# Altium project DeepPlankter_main.PrjPcb (part 2 of 2)

## Sheet power_connector.SchDoc
size A4
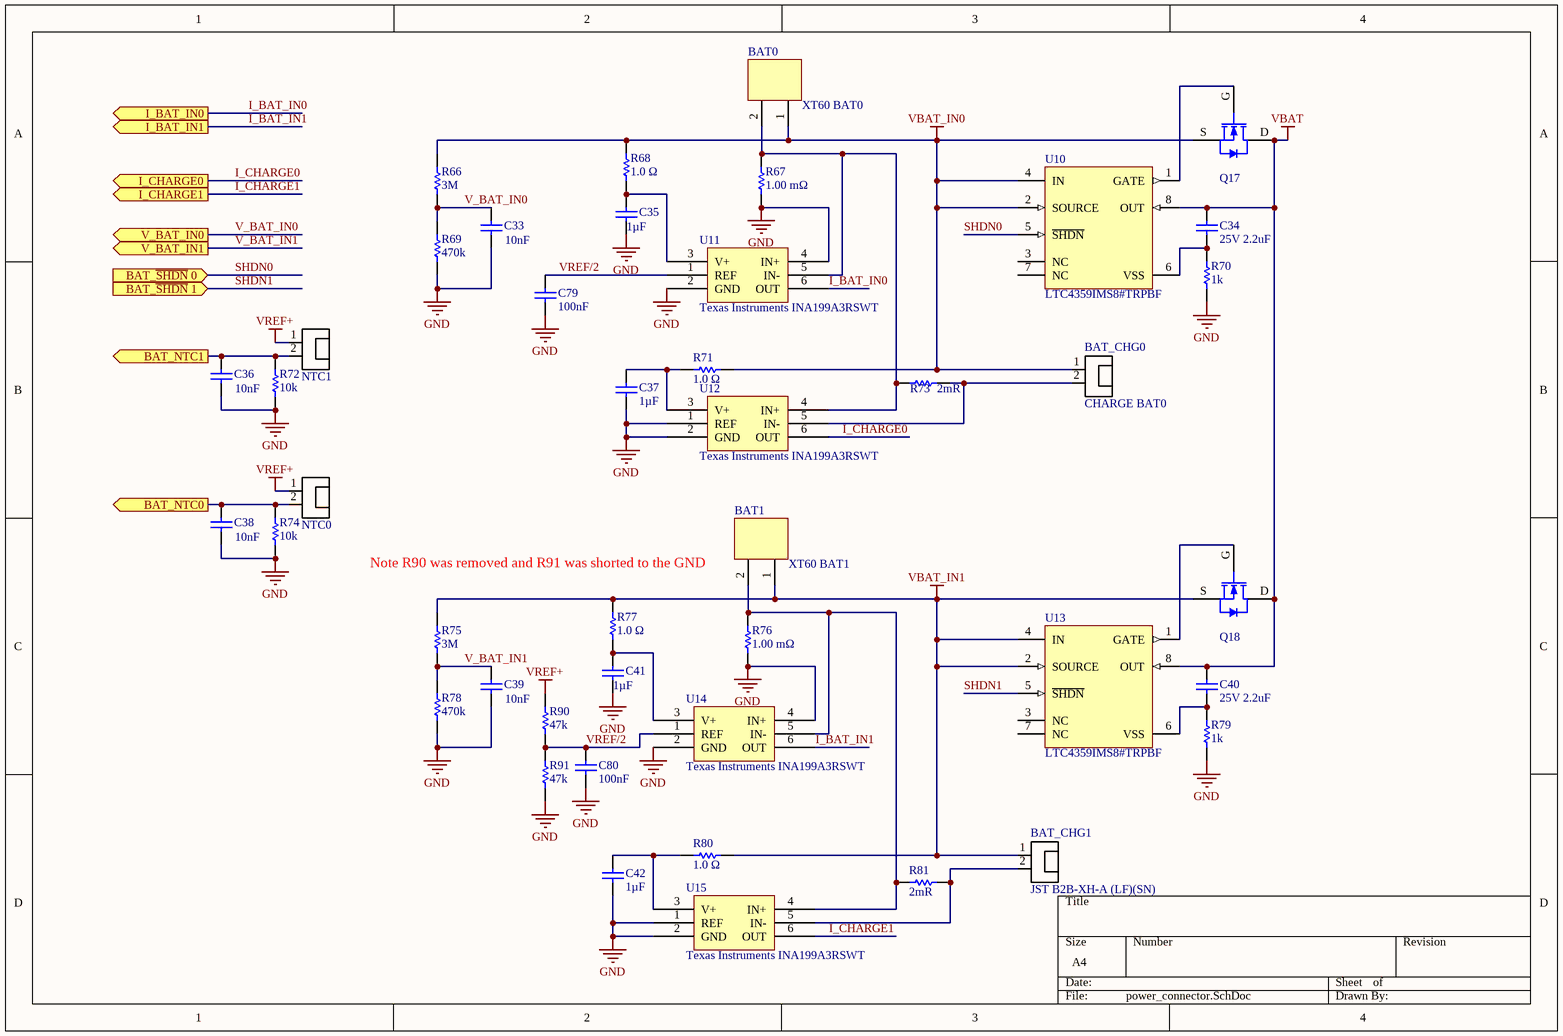
[diagram p5: power_connector.SchDoc]

### Parts
BAT0  XT60 BAT0  [PCB-8tmbcd94dx0l5ponnqur-1]
BAT1  XT60 BAT1  [PCB-8tmbcd94dx0l5ponnqur-1]
BAT_CHG0  CHARGE BAT0  [PCB-s8s8ac3ylnu6waak0fxh-1]
BAT_CHG1  JST B2B-XH-A (LF)(SN)  [PCB-s8s8ac3ylnu6waak0fxh-1]
C33  10nF  [RESC1005X40X25LL05T05]
C34  25V 2.2uF  [C0805]
C35  1µF  [CAPC1608X90X35LL15T15]
C36  10nF  [RESC1005X40X25LL05T05]
C37  1µF  [CAPC1608X90X35LL15T15]
C38  10nF  [RESC1005X40X25LL05T05]
C39  10nF  [RESC1005X40X25LL05T05]
C40  25V 2.2uF  [C0805]
C41  1µF  [CAPC1608X90X35LL15T15]
C42  1µF  [CAPC1608X90X35LL15T15]
C79  100nF  [CAPC1005X56X25NL10T15]
C80  100nF  [CAPC1005X56X25NL10T15]
NTC0  JST B2B-XH-A (LF)(SN)  [PCB-s8s8ac3ylnu6waak0fxh-1]  (value not drawn)
NTC1  JST B2B-XH-A (LF)(SN)  [PCB-s8s8ac3ylnu6waak0fxh-1]  (value not drawn)
Q17  SYM-77c1bbb3bdeca806-1  [PCB-0cgmvcmmtwpbvwdhxnni-1]  (value not drawn)
Q18  SYM-77c1bbb3bdeca806-1  [PCB-0cgmvcmmtwpbvwdhxnni-1]  (value not drawn)
R66  3M  [RESC1608X55X30LL15T15]
R67  1.00 mΩ  [PCB-wws5gc0zzodyoofoa1sn-1]
R68  1.0 Ω  [RESC1609X50X30LL10T20]
R69  470k  [RESC1609X55X30LL10T20]
R70  1k  [RESC1608X55X30NL15T15]
R71  1.0 Ω  [RESC1609X50X30LL10T20]
R72  10k  [RESC1608X55X30NL15T15]
R73  2mR  [RESC3216X89X51ML25T25]
R74  10k  [RESC1608X55X30NL15T15]
R75  3M  [RESC1608X55X30LL15T15]
R76  1.00 mΩ  [PCB-wws5gc0zzodyoofoa1sn-1]
R77  1.0 Ω  [RESC1609X50X30LL10T20]
R78  470k  [RESC1609X55X30LL10T20]
R79  1k  [RESC1608X55X30NL15T15]
R80  1.0 Ω  [RESC1609X50X30LL10T20]
R81  2mR  [RESC3216X89X51ML25T25]
R90  47k  [RESC1005X40X25LL05T10]
R91  47k  [RESC1005X40X25LL05T10]
U10  LTC4359IMS8#TRPBF  [LT-MS8-8_L]
U11  Texas Instruments INA199A3RSWT  [PCB-dzg43p1s5wcf61j10amz-1]
U12  Texas Instruments INA199A3RSWT  [PCB-dzg43p1s5wcf61j10amz-1]
U13  LTC4359IMS8#TRPBF  [LT-MS8-8_L]
U14  Texas Instruments INA199A3RSWT  [PCB-dzg43p1s5wcf61j10amz-1]
U15  Texas Instruments INA199A3RSWT  [PCB-dzg43p1s5wcf61j10amz-1]

### Ports
BAT_NTC0 (out), BAT_NTC1 (out), BAT_~{SHDN} 0 (in), BAT_~{SHDN} 1 (in), I_BAT_IN0 (out), I_BAT_IN1 (out), I_CHARGE0 (out), I_CHARGE1 (out), V_BAT_IN0 (out), V_BAT_IN1 (out)

### Nets
GND: C33.1 C35.2 C36.1 C37.2 C38.1 C39.1 C41.2 C42.2 C79.2 C80.2 R67.1 R69.1 R70.1 R72.1 R74.2 R76.1 R78.1 R79.1 R91.1 U11.2(GND) U11.4(IN+) U12.1(REF) U12.2(GND) U14.2(GND) U14.4(IN+) U15.1(REF) U15.2(GND)
VBAT: C34.1 C40.1 Q17.D Q18.D U10.8(OUT) U13.8(OUT)
VBAT_IN0: BAT0.1 BAT_CHG0.1 Q17.S R66.2 R68.2 R71.2 U10.2(SOURCE) U10.4(IN)
VBAT_IN1: BAT1.1 BAT_CHG1.1 Q18.S R75.2 R77.2 R80.2 U13.2(SOURCE) U13.4(IN)
VREF+: NTC0.1 NTC1.1 R90.2
ADC_CH0: C38.2 NTC0.2 R74.1 ; port BAT_NTC0
ADC_CH11: C36.2 NTC1.2 R72.2 ; port BAT_NTC1
I_BAT_IN0: U11.6(OUT) ; port I_BAT_IN0  [project net ADC_CH17]
I_BAT_IN1: U14.6(OUT) ; port I_BAT_IN1  [project net ADC_CH4]
I_CHARGE0: U12.6(OUT) ; port I_CHARGE0  [project net ADC_CH16]
I_CHARGE1: U15.6(OUT) ; port I_CHARGE1  [project net ADC_CH7]
SHDN0: U10.5(~{SHDN}) ; port BAT_~{SHDN} 0  [project net BAT0_EN]
SHDN1: U13.5(~{SHDN}) ; port BAT_~{SHDN} 1  [project net BAT1_EN]
V_BAT_IN0: C33.2 R66.1 R69.2 ; port V_BAT_IN0  [project net ADC_CH1]
V_BAT_IN1: C39.2 R75.1 R78.2 ; port V_BAT_IN1  [project net ADC_CH10]
VREF/2: C79.1 C80.1 R90.1 R91.2 U11.1(REF) U14.1(REF)
NetBAT0_2: BAT0.2 R67.2 R73.2 U11.5(IN-) U12.4(IN+)
NetBAT1_2: BAT1.2 R76.2 R81.1 U14.5(IN-) U15.4(IN+)
NetBAT_CHG0_2: BAT_CHG0.2 R73.1 U12.5(IN-)
NetBAT_CHG1_2: BAT_CHG1.2 R81.2 U15.5(IN-)
NetC34_2: C34.2 R70.2 U10.6(VSS)
NetC35_1: C35.1 R68.1 U11.3(V+)
NetC37_1: C37.1 R71.1 U12.3(V+)
NetC40_2: C40.2 R79.2 U13.6(VSS)
NetC41_1: C41.1 R77.1 U14.3(V+)
NetC42_1: C42.1 R80.1 U15.3(V+)
NetQ17_G: Q17.G U10.1(GATE)
NetQ18_G: Q18.G U13.1(GATE)

Not connected (* = marked no-connect by the designer): U10 3(NC) 7(NC); U13 3(NC) 7(NC)

### Notes on the sheet
- (near BAT1) Note R90 was removed and R91 was shorted to the GND

### Library data of the parts
BAT0 BAT1 = CMP-d8151592827e07d2-9: XT60 Connector Male
BAT_CHG0 = CMP-a2a66bdac84f7d61-16: XH Series 2 Position 2.5 mm Pitch Through Hole Top Entry Shrouded Header; Manufacturer Part Number: B2B-XH-A (LF)(SN); Gender: Male; Voltage Rating (AC): 250 V; Lead-Free Status: Lead Free; Insulation Resistance: 1.00 GΩ; Number of Contacts: 2; Contact Resistance: 10.0 mΩ; Current Rating: 3.00 A; Mounting Style: Through Hole, Vertical; RoHS: Compliant; Octopart URL: http://octopart.com/b2b-xh-a+%28lf%29%28sn%29-jst-7753615; Contact Material: Brass; REACH SVHC Compliance: No SVHC; OctopartID: a2a66bdac84f7d61; Contact Plating: Tin
BAT_CHG1 NTC0 NTC1 = CMP-a2a66bdac84f7d61-16: XH Series 2 Position 2.5 mm Pitch Through Hole Top Entry Shrouded Header; Gender: Male; Voltage Rating (AC): 250 V; Lead-Free Status: Lead Free; Insulation Resistance: 1.00 GΩ; Number of Contacts: 2; Contact Resistance: 10.0 mΩ; Current Rating: 3.00 A; Mounting Style: Through Hole, Vertical; RoHS: Compliant; Manufacturer Part Number: B2B-XH-A (LF)(SN); Octopart URL: http://octopart.com/b2b-xh-a+%28lf%29%28sn%29-jst-7753615; Contact Material: Brass; REACH SVHC Compliance: No SVHC; OctopartID: a2a66bdac84f7d61; Contact Plating: Tin
C33 C36 C38 C39 = CMP-16527022-3: 0.01uF Capacitor; Manufacturer Part Number: 04025C103KAT2A; Capacitance Tolerance: ±10%; Voltage Rating (DC): 50.0 V; Dielectric Characteristic: X7R; Lead-Free Status: Lead Free; Capacitance: 1e-08 F; Octopart Url: https://octopart.com/04025c103kat2a-avx+interconnect+%2F+elco-20614010; OctopartID: 72f7bac7dcebad30; REACH SVHC Compliance: No SVHC; Packaging: Cut Tape (CT); RoHS: Compliant; Case/Package: 0402
C34 C40 = CMP-84b64f3479215b71-1: 0805 2.2 uF 25 V ±10 % Tolerance X7R SMT Multilayer Ceramic Capacitor; Manufacturer Part Number: CC0805KKX7R8BB225; Lead-Free Status: Lead Free; Capacitance Tolerance: ±10%; Voltage Rating (DC): 25.0 V; Capacitance: 2.2e-06 F; Halogen Free Status: Halogen Free; Seller Landing  Url: https://octopart-clicks.com/click/track?country=US&ak=8157f166&sig=0c113c1&sid=2402&ppid=42522865&vpid=20053140&ct=offers; Packaging: Cut Tape (CT); Mounting Style: Surface Mount; Case/Package: 0805; REACH SVHC Compliance: No SVHC; Number of Pins: 2; OctopartID: 84b64f3479215b71; Dielectric Characteristic: X7R; RoHS: Compliant; Octopart Url: http://octopart.com/cc0805kkx7r8bb225-yageo-42522865
C35 C37 C41 C42 = CMP-f2f83b8d074c2d3f-6: as C4 on sheet aux_powers; Dielectric Characteristic: X5R; Mounting Style: Surface Mount; OctopartID: f2f83b8d074c2d3f
C79 C80 = CMP-bf2276a55d9a60e5-19: Ceramic capacitor SMD-0402 100nF /16V X7R# K +-10%, Samsung, RoHS; Dielectric Characteristic: X7R; Lead-Free Status: Lead Free; Mounting Style: Surface Mount; Capacitance: 100 nF; Case/Package: 0402; OctopartID: 0755ced2c795d892
Q17 Q18 = CMP-77c1bbb3bdeca806-1: Trans MOSFET N-CH 60V 42.8A 8-Pin PowerPAK SO-DC EP T/R; Manufacturer Part Number: SIDR626DP-T1-GE3; Operating Temperature: 150 °C (max); OctopartID: 77c1bbb3bdeca806
R66 R75 = CMP-3654610-2: Thick Film Resistors - SMD 0603 3Mohms 5% Tol; Manufacturer Part Number: ERJ-3GEYJ305V; Power Rating: 0.1 W; Resistance: 3000000.0 Ω; Voltage Rating (DC): 75.0 V; Case/Package: 0603; Lifecycle Status: Not Listed by Manufacturer; Mounting Style: Surface Mount; Octopart Url: https://octopart.com/erj-3geyj305v-panasonic-39833078; OctopartID: 96625d377ef249a5; Packaging: Cut Tape (CT); REACH SVHC Compliance: No SVHC; Resistance Tolerance: ±5%; RoHS: Compliant; Size-Height: 0.00045 m; Size-Length: 0.0016 m; Size-Width: 0.0008 m
R67 R76 = CMP-5c9b974035f1835c-1: Res Thick Film 2512 0.001 Ohm 1% 3W ±50ppm/C Pad SMD Automotive T/R; Manufacturer Part Number: CRE2512-FZ-R001E-3; Power Rating: 3.00 W; Temperature Coefficient: -75.0 ppm/°C to 75.0 ppm/°C; Mounting Style: Solder; RoHS: Compliant; Packaging: Tape & Reel (TR), Cut Tape (CT); Resistance: 1.00 mΩ; Resistance Tolerance: ±1%; OctopartID: 5c9b974035f1835c; Octopart URL: https://octopart.com/cre2512-fz-r001e-3-bourns-47270924; REACH SVHC Compliance: No SVHC
R68 R71 R77 R80 = CMP-1856057-2: RES SMD 1 OHM 5% 1/10W 0603; Manufacturer Part Number: CRCW06031R00JNEA; Lead-Free Status: Lead Free; Power Rating: 0.1 W; Temperature Coefficient: 200.0 ppm/°C; Voltage Rating (DC): 75.0 V; Case/Package: 0603; Mounting Style: Surface Mount; Number of Pins: 2; Octopart Url: https://octopart.com/crcw06031r00jnea-vishay-39838014; OctopartID: a4176f42604f7bd0; Packaging: Cut Tape (CT); Resistance: 1.0 Ω; Resistance Tolerance: ±5%; RoHS: Compliant; Size-Height: 0.00045 m; Size-Length: 0.00155 m; Size-Width: 0.00085 m
R69 R78 = CMP-d1221a8dcd300ee5-2: Res Thick Film 0603 1M Ohm 1% 0.33W(1/3W) ±100ppm/°C Pad SMD Automotive T/R; Manufacturer Part Number: CRCW06031M00FKEAHP; Lead-Free Status: Lead Free; Voltage Rating (DC): 75.0 V; Resistance: 1.00 MΩ; Power Rating: 250 mW; Min Operating Temperature: -55 °C; RoHS: Compliant; OctopartID: 44b98f1658ac9b7e; Mounting Style: Surface Mount; Octopart URL: https://octopart.com/crcw06031m00fkeahp-vishay-44382579; Packaging: Reel; Max Operating Temperature: 155 °C; Case/Package: 0603
R70 R79 = CMP-68a0a2e72c4eb767-21: Res Thick Film 0603 1K Ohm 5% 1/10W ±100ppm/°C Molded SMD SMD Paper T/R
R72 R74 = CMP-a8e96364fc37772e-4: Res Thin Film 0603 10K Ohm 1% 1/16W ±50ppm/°C Molded SMD SMD Paper T/R; ELV Compliant: Compliant; Power Rating: 63.0 mW; Case/Package (SI): 1608; Packaging: Tape & Reel (TR)
R73 R81 = CMP-1863047-2: Res Metal Strip 1206 0.02 Ohm 1% 0.25W(1/4W) ±75ppm/C Molded SMD Automotive Embossed Plastic T/R; Manufacturer Part Number: WSL1206R0200FEA; Case/Package (SI): 3216; Lead-Free Status: Lead Free; Resistance: 0.02 Ω; Mounting Style: Surface Mount; Number of Pins: 2; Octopart Url: https://octopart.com/wsl1206r0200fea-vishay-39744192; OctopartID: 364ffd1b61e9e988; Power Rating: 0.25 W; REACH SVHC Compliance: No SVHC; Resistance Tolerance: ±1%; RoHS: Compliant; Size-Height: 0.000635 m; Size-Length: 0.0032004 m; Size-Width: 0.0016002 m
R90 R91 = CMP-1859043-2: Thick Film Resistors - SMD 1/8watt 47Kohms 1% 100ppm High Power; Manufacturer Part Number: CRCW040247K0FKEDHP; Lead-Free Status: Lead Free; Power Rating: 0.063 W; Resistance: 47000.0 Ω; Case/Package: 0402; Octopart Url: https://octopart.com/crcw040247k0fkedhp-vishay+dale-44383189; OctopartID: 3aaef101241de569; Resistance Tolerance: ±1%; RoHS: Compliant
U10 U13 = CMP-3088331-2: Ideal Diode Controller with Reverse Input Protection, 4 to 80 V Vin, 8-pin SOP (MS8-8), -40 to 85 degC, Pb-Free, Tape and Reel; Manufacturer Part Number: LTC4359IMS8#TRPBF; Octopart Url: https://octopart.com/ltc4359ims8%23trpbf-linear+technology-22629374; OctopartID: a3b26be1cd2a7c75; RoHS: Compliant
U11 U12 U14 U15 = CMP-0f05c77d0cddd0c2-11: 26-V, Bi-Directional, Zero-Drift, Low- or High-Side, Voltage Output Current Shunt Monitor 6-SC70 -40 to 125; Lead-Free Status: Lead Free; Mounting Style: Surface Mount; RoHS: Compliant; Octopart URL: http://octopart.com/ina199b3dckr-texas+instruments-24258238; OctopartID: 0f05c77d0cddd0c2

## Sheet power_suppliers.SchDoc
size A4
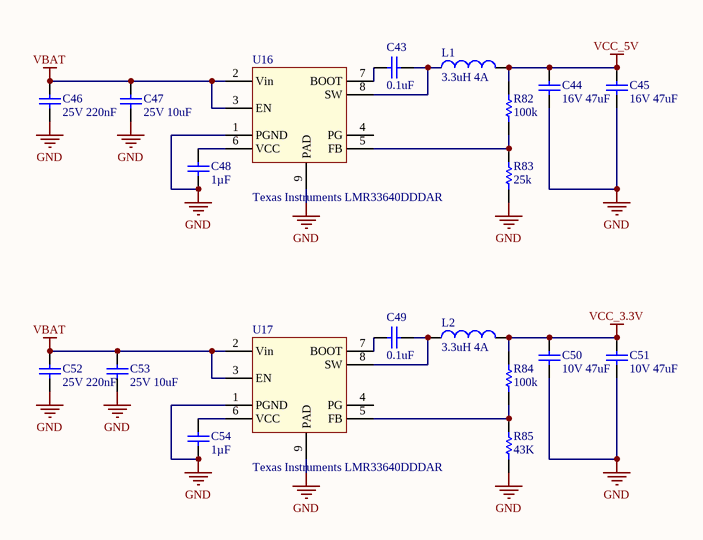
[diagram p6: power_suppliers.SchDoc]

### Parts
C43  0.1uF  [CAPC1608X90X35LL15T15]
C44  16V 47uF  [PCB-h26gble9h939l4c191wl-1]
C45  16V 47uF  [PCB-h26gble9h939l4c191wl-1]
C46  25V 220nF  [CAPC1608X90X35LL15T15]
C47  25V 10uF  [CAPC3225X279X50NL20T25]
C48  1µF  [CAPC1608X90X35ML15T15]
C49  0.1uF  [CAPC1608X90X35LL15T15]
C50  10V 47uF  [PCB-h26gble9h939l4c191wl-1]
C51  10V 47uF  [PCB-h26gble9h939l4c191wl-1]
C52  25V 220nF  [CAPC1608X90X35LL15T15]
C53  25V 10uF  [CAPC3225X279X50NL20T25]
C54  1µF  [CAPC1608X90X35ML15T15]
L1  3.3uH 4A  [PCB-nnnro8dea2m4q1g7ugdq-1]
L2  3.3uH 4A  [PCB-nnnro8dea2m4q1g7ugdq-1]
R82  100k  [RESC1608X55X30LL15T15]
R83  25k  [RESC1609X50X30LL10T20]
R84  100k  [RESC1608X55X30LL15T15]
R85  43K  [RESC1608X55X30LL15T15]
U16  Texas Instruments LMR33640DDDAR  [PCB-6od3ifqvrl04n4lmrw41-1]
U17  Texas Instruments LMR33640DDDAR  [PCB-6od3ifqvrl04n4lmrw41-1]

### Nets
GND: C44.2 C45.2 C46.1 C47.1 C48.2 C50.2 C51.2 C52.1 C53.1 C54.2 R83.1 R85.1 U16.1(PGND) U16.9(PAD) U17.1(PGND) U17.9(PAD)
VBAT: C46.2 C47.2 C52.2 C53.2 U16.2(Vin) U16.3(EN) U17.2(Vin) U17.3(EN)
VCC_3.3V: C50.1 C51.1 L2.2 R84.2
VCC_5V: C44.1 C45.1 L1.2 R82.2
NetC43_1: C43.1 U16.7(BOOT)
NetC43_2: C43.2 L1.1 U16.8(SW)
NetC48_1: C48.1 U16.6(VCC)
NetC49_1: C49.1 U17.7(BOOT)
NetC49_2: C49.2 L2.1 U17.8(SW)
NetC54_1: C54.1 U17.6(VCC)
NetR82_1: R82.1 R83.2 U16.5(FB)
NetR84_1: R84.1 R85.2 U17.5(FB)

Not connected (* = marked no-connect by the designer): U16 4(PG); U17 4(PG)

### Library data of the parts
C43 C49 = CMP-175023-2: Cap Ceramic 0.1uF 16V X7R 10% SMD 0603 125C Paper T/R; Manufacturer Part Number: 0603YC104K4T2A; Capacitance: 1e-07 F; Lead-Free Status: Lead Free; Voltage Rating (DC): 16.0 V; Capacitance Tolerance: ±10%; Case/Package: 0603; Dielectric Characteristic: X7R; Mounting Style: Surface Mount; Number of Pins: 2; Octopart Url: https://octopart.com/0603yc104k4t2a-avx+interconnect+%2F+elco-8120651; OctopartID: 8dfd448c41d0523a; Packaging: Tape; REACH SVHC Compliance: No SVHC; RoHS: Compliant
C44 C45 C50 C51 = CMP-cdd204dbeb8b1215-2: 1210 47 uF 10 V ±10% Tolerance X5R SMT Multilayer Ceramic Capacitor; Manufacturer Part Number: GRM32ER61A476KE20L; Capacitance: 47.0 µF; Voltage Rating (DC): 10.0 V; Case/Package (SI): 3225; Lead-Free Status: Lead Free; Size-Length: 3.20 mm; Packaging: Cut Tape (CT), Tape & Reel (TR); Size-Width: 2.50 mm; Size-Height: 2.50 mm; RoHS: Compliant; Dielectric Characteristic: X5R; Size-Thickness: 2.50 mm; Case/Package: 1210; Capacitance Tolerance: ±10%; Lifecycle Status: Active; REACH SVHC Compliance: No SVHC; Number of Pins: 2; OctopartID: cdd204dbeb8b1215; Mounting Style: Surface Mount; Octopart URL: http://octopart.com/grm32er61a476ke20l-murata-197439
C46 C52 = CMP-126800-2: CAP CER 0.22UF 25V 10% X5R 0603; Manufacturer Part Number: 06033D224KAT2A; Capacitance: 2.2e-07 F; Dielectric Material: Ceramic Multilayer; Lead-Free Status: Lead Free; Voltage Rating (DC): 25.0 V; Capacitance Tolerance: ±10%; Case/Package: 0603; Dielectric Characteristic: X5R; Mounting Style: Surface Mount; Number of Pins: 2; Octopart Url: https://octopart.com/06033d224kat2a-avx+interconnect+%2F+elco-194837; OctopartID: 9cd555dd40a64312; REACH SVHC Compliance: No SVHC; RoHS: Compliant; Size-Height: 0.00086 m; Size-Length: 0.0016 m; Size-Width: 0.00081 m
C47 C53 = CMP-127194-2: CAP CER 10UF 25V 10% X5R 1210; Manufacturer Part Number: 12103D106KAT2A; Capacitance: 1e-05 F; Dielectric Material: Ceramic Multilayer; Lead-Free Status: Lead Free; Voltage Rating (DC): 25.0 V; Capacitance Tolerance: ±10%; Case/Package: 1210; Dielectric Characteristic: X5R; Mounting Style: Surface Mount; Number of Pins: 2; Octopart Url: https://octopart.com/12103d106kat2a-avx+interconnect+%2F+elco-46506207; OctopartID: afcd64022a74700a; REACH SVHC Compliance: No SVHC; RoHS: Compliant; Size-Height: 0.00229 m; Size-Length: 0.0032 m; Size-Width: 0.0025 m
C48 C54 = CMP-f2f83b8d074c2d3f-6: as C4 on sheet aux_powers; Dielectric Characteristic: X5R; Mounting Style: Surface Mount; OctopartID: f2f83b8d074c2d3f
L1 L2 = CMP-d4431d2f1dc30b84-1: Power inductor, shielded, 10/20/30% tol, SMT, RoHS; Manufacturer Part Number: MSS1048-683MLC; Lead-Free Status: Contains Lead; Inductance: 68.0 µH; Self Resonant Frequency: 7.00 MHz; Mounting Style: Surface Mount; Packaging: Cut Tape (CT), Tape & Reel (TR); OctopartID: d4431d2f1dc30b84; RoHS: Compliant; Octopart URL: https://octopart.com/mss1048-683mlc-coilcraft-6745318; Lifecycle Status: Active
R82 R84 = CMP-9abf51c576ad4578-20: Res General Purpose Thick Film 0603 100k Ohm 1% 1/10W ±100ppm/°C Molded Paper T/R
R83 = CMP-1857223-2: RES SMD 25.5K OHM 1% 1/10W 0603; Manufacturer Part Number: CRCW060325K5FKEA; Lead-Free Status: Lead Free; Power Rating: 0.1 W; Resistance: 25500.0 Ω; Temperature Coefficient: 100.0 ppm/°C; Voltage Rating (DC): 75.0 V; Case/Package: 0603; Mounting Style: Surface Mount; Number of Pins: 2; Octopart Url: https://octopart.com/crcw060325k5fkea-vishay-39836292; OctopartID: d1e11ab42e030e26; REACH SVHC Compliance: No SVHC; Resistance Tolerance: ±1%; RoHS: Compliant; Size-Height: 0.00045 m; Size-Length: 0.00155 m; Size-Width: 0.00085 m
R85 = CMP-3653524-2: Thick Film Resistors - SMD 0603 43Kohms 5% Tol; Manufacturer Part Number: ERJ-3GEYJ433V; Lead-Free Status: Lead Free; Power Rating: 0.1 W; Resistance: 43000.0 Ω; Voltage Rating (DC): 75.0 V; Case/Package: 0603; Lifecycle Status: Not Listed by Manufacturer; Mounting Style: Surface Mount; Octopart Url: https://octopart.com/erj-3geyj433v-panasonic-55422106; OctopartID: 0ae6c0a1831ad521; Packaging: Cut Tape (CT); REACH SVHC Compliance: No SVHC; Resistance Tolerance: ±5%; RoHS: Compliant; Size-Height: 0.00045 m; Size-Length: 0.0016 m; Size-Width: 0.0008 m
U16 U17 = CMP-bb02745c510e64c5-3: SIMPLE SWITCHER Synchronous Step-Down Converter 3.8V to 36V Input 4A 8-Pin SO PowerPAD T/R; OctopartID: bb02745c510e64c5

## Sheet memory.SchDoc
size A4
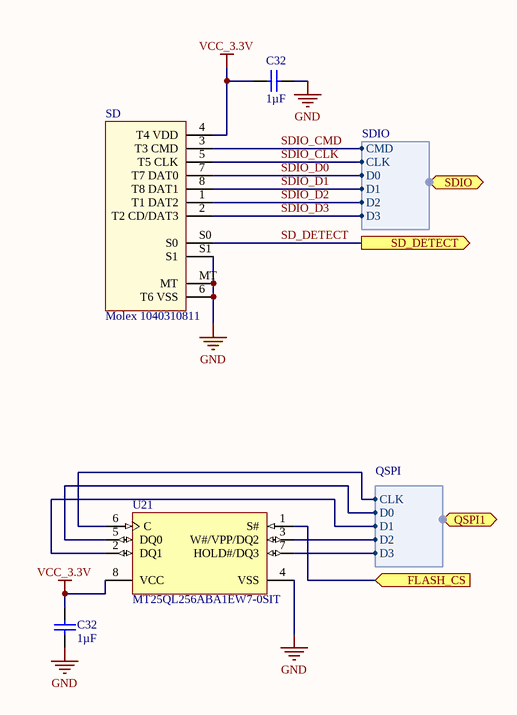
[diagram p7: memory.SchDoc]

### Parts
(Parts that share a designator on the sheet are numbered #1, #2 ... from top to bottom, then left to right.)
C32#1  1µF  [CAPC1608X90X35LL15T15]
C32#2  1µF  [CAPC1608X90X35LL15T15]
SD  Molex 1040310811  [PCB-e07cv7eyfg1wxdj7ioop-1]
U21  MT25QL256ABA1EW7-0SIT  [Micron W7 PDFN-8 MLP-8]

### Ports
FLASH_CS (in), QSPI1 (harness QSPI), SD_DETECT (out), SDIO (harness SDIO)

### Harnesses
SDIO: CLK, CMD, D0, D1, D2, D3
QSPI: CLK, D0, D1, D2, D3

### Nets
GND: C32#1.2 C32#2.1 SD.6(T6_VSS) SD.MT SD.S1 U21.4(VSS)
VCC_3.3V: C32#1.1 C32#2.2 SD.4(T4_VDD) U21.8(VCC)
QSPI1_CLK: U21.6(C) ; port QSPI1.CLK
QSPI1_D0: U21.5(DQ0) ; port QSPI1.D0
QSPI1_D1: U21.2(DQ1) ; port QSPI1.D1
QSPI1_D2: U21.3(W#/VPP/DQ2) ; port QSPI1.D2
QSPI1_D3: U21.7(HOLD#/DQ3) ; port QSPI1.D3
QSPI1_FLASH_CS: U21.1(S#) ; port FLASH_CS
SD_DETECT: SD.S0 ; port SD_DETECT
SDIO_CLK: SD.5(T5_CLK) ; port SDIO.CLK
SDIO_CMD: SD.3(T3_CMD) ; port SDIO.CMD
SDIO_D0: SD.7(T7_DAT0) ; port SDIO.D0
SDIO_D1: SD.8(T8_DAT1) ; port SDIO.D1
SDIO_D2: SD.1(T1_DAT2) ; port SDIO.D2
SDIO_D3: SD.2(T2_CD/DAT3) ; port SDIO.D3

### Library data of the parts
C32#1 C32#2 = CMP-f2f83b8d074c2d3f-6: as C4 on sheet aux_powers; Dielectric Characteristic: X5R; Mounting Style: Surface Mount; OctopartID: f2f83b8d074c2d3f
SD = CMP-a4a36cb6bd117b64-5: 1.10mm Pitch microSD Memory Card Connector, SMT, Push-Pull Type, 1.42mm Height, with Detect Switch
U21 = CMP-fb1530fa0f9224d2-1: NOR Flash Serial-SPI 3.3V 256Mbit 256M x 1bit 8-Pin WPDFN; Manufacturer Part Number: MT25QL256ABA1EW7-0SIT

## Sheet camera.SchDoc
size A4
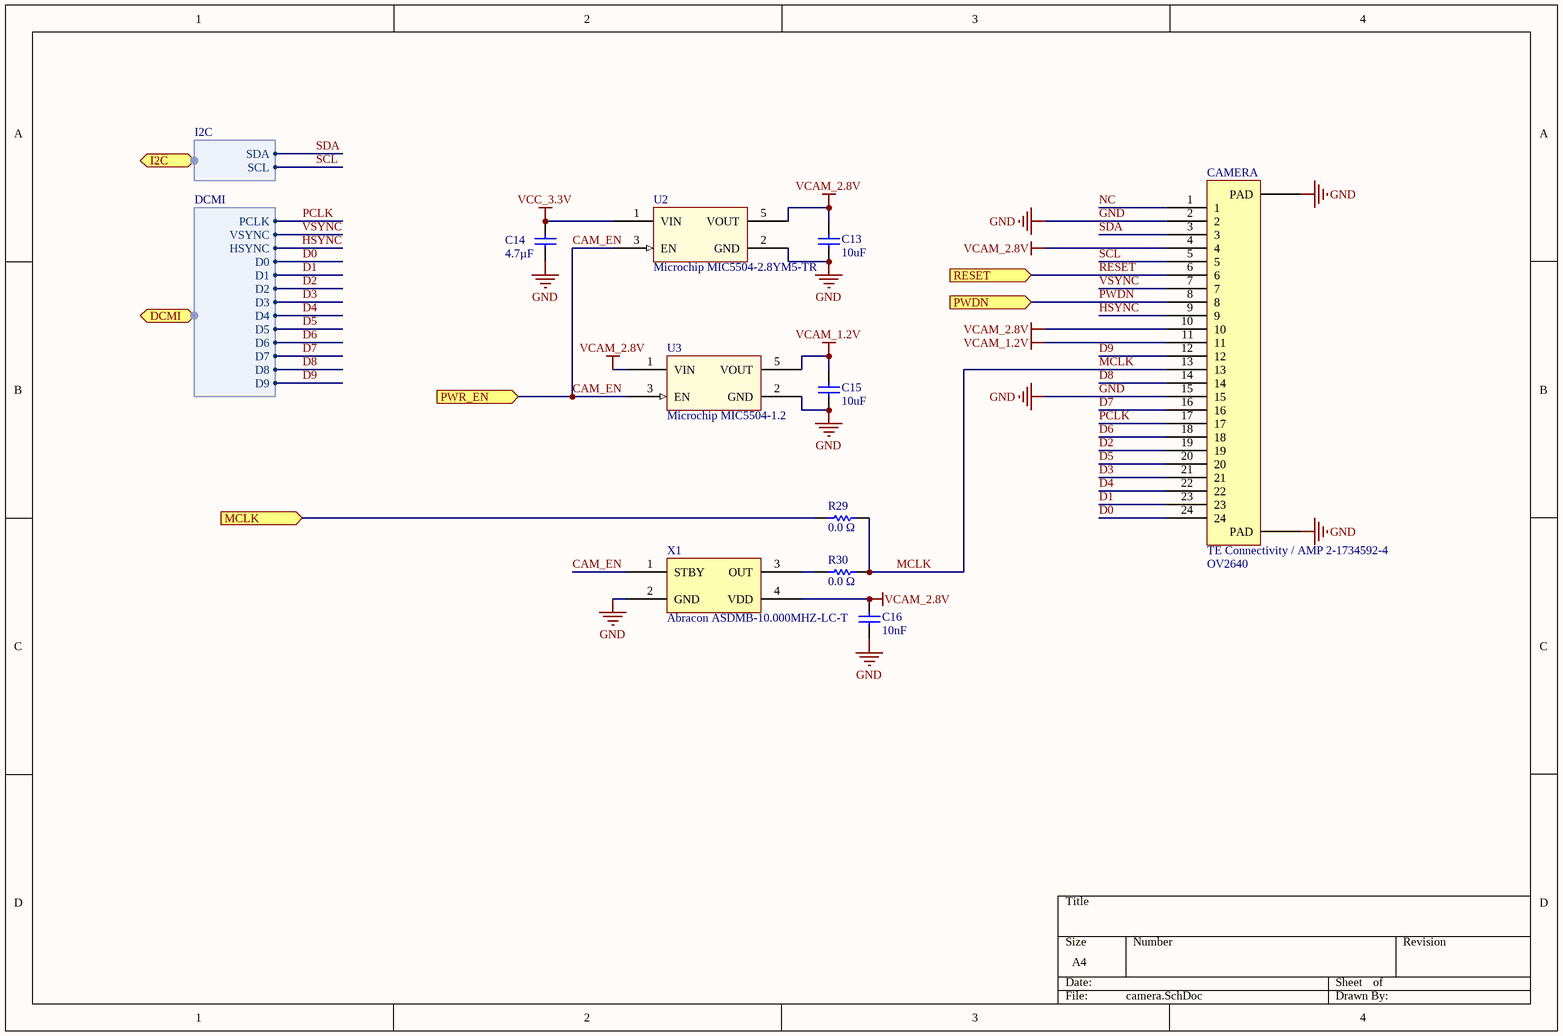
[diagram p8: camera.SchDoc]

### Parts
C13  10uF  [PCB-7x9sd7nowcb4nx8jmhok-1]
C14  4.7µF  [CAPC1608X90X35LL15T15]
C15  10uF  [PCB-7x9sd7nowcb4nx8jmhok-1]
C16  10nF  [RESC1005X40X25LL05T05]
CAMERA  TE Connectivity / AMP 2-1734592-4  [SOP48]
R29  0.0 Ω  [RESC1608X55X25LL10T15]
R30  0.0 Ω  [RESC1608X55X25LL10T15]
U2  Microchip MIC5504-2.8YM5-TR  [PCB-87v9kgqs8q23ekp4z6f0-1]
U3  Microchip MIC5504-1.2  [PCB-87v9kgqs8q23ekp4z6f0-1]
X1  Abracon ASDMB-10.000MHZ-LC-T  [PCB-wrjz21e0na9s1qg4p3ls-1]

### Ports
DCMI (harness DCMI), I2C (harness I2C), MCLK (in), PWDN (in), PWR_EN (in), RESET (in)

### Harnesses
DCMI: PCLK, VSYNC, HSYNC, D0, D1, D2, D3, D4, D5, D6, D7, D8, D9
I2C: SCL, SDA

### Nets
GND: C13.1 C14.1 C15.1 C16.1 CAMERA.2 CAMERA.15 CAMERA.?1(PAD) CAMERA.?2(PAD) U2.2(GND) U3.2(GND) X1.2(GND)
VCAM_1.2V: C15.2 CAMERA.11 U3.5(VOUT)
VCAM_2.8V: C13.2 C16.2 CAMERA.4 CAMERA.10 U2.5(VOUT) U3.1(VIN) X1.4(VDD)
VCC_3.3V: C14.2 U2.1(VIN)
CAM_EN: U2.3(EN) U3.3(EN) X1.1(STBY) ; port PWR_EN
D0: CAMERA.24 ; port DCMI.D0
D1: CAMERA.23 ; port DCMI.D1
D2: CAMERA.19 ; port DCMI.D2
D3: CAMERA.21 ; port DCMI.D3
D4: CAMERA.22 ; port DCMI.D4
D5: CAMERA.20 ; port DCMI.D5
D6: CAMERA.18 ; port DCMI.D6
D7: CAMERA.16 ; port DCMI.D7
D8: CAMERA.14 ; port DCMI.D8
D9: CAMERA.12 ; port DCMI.D9
HSYNC: CAMERA.9 ; port DCMI.HSYNC  [project net DCMI_HSYNC]
MCLK: CAMERA.13 R29.1 R30.1
MCO_OUT: R29.2 ; port MCLK
NC: CAMERA.1
PCLK: CAMERA.17 ; port DCMI.PCLK  [project net DCMI_PIXCLK]
PWDN: CAMERA.8 ; port PWDN  [project net CAM_PWDN]
RESET: CAMERA.6 ; port RESET  [project net CAM_RESET]
SCL: CAMERA.5 ; port I2C.SCL  [project net I2C2_SCL]
SDA: CAMERA.3 ; port I2C.SDA  [project net I2C2_SDA]
VSYNC: CAMERA.7 ; port DCMI.VSYNC  [project net DCMI_VSYNC]
NetR30_2: R30.2 X1.3(OUT)

### Notes on the sheet
- (near CAMERA) OV2640

### Library data of the parts
C13 C15 = CMP-9bf553a3f2f54432-1: 0603 10 uF 10 V ±20 % Tolerance X5R Surface Mount Multilayer Ceramic Capacitor; Lead-Free Status: Lead Free; Capacitance Tolerance: ±20%; Capacitance: 10.0 F; Operating Temperature: -55.0 °C (min); Case/Package: 0603; Dielectric Characteristic: X5R; OctopartID: 9bf553a3f2f54432; Lifecycle Status: Not Listed by Manufacturer; Packaging: Cut Tape (CT)
C14 = CMP-147010-6: 0603 4.7 uF 10 V ±10 % Tolerance X5R SMT Multilayer Ceramic Capacitor; Voltage Rating (DC): 10.0 V; Capacitance Tolerance: ±10%; Lead-Free Status: Lead Free; Capacitance: 4.70 µF; Operating Temperature: -55.0 °C to 85.0 °C; Dielectric Characteristic: X5R; OctopartID: 876b4eec68d658ac; Octopart URL: https://octopart.com/cc0603krx5r6bb475-yageo-9292507; Number of Pins: 2; Mounting Style: Surface Mount; RoHS: Compliant
C16 = CMP-16527022-3: as C33 on sheet power_connector; Octopart Url: https://octopart.com/04025c103kat2a-avx+interconnect+%2F+elco-20614010; OctopartID: 72f7bac7dcebad30; REACH SVHC Compliance: No SVHC; Packaging: Cut Tape (CT); RoHS: Compliant; Case/Package: 0402
CAMERA = CMP-9e32555c798341f5-2: Ffc/Fpc Connector, Receptacle 24 Position 1row, Full Reel
R29 R30 = CMP-3661350-4: as R86 on sheet sensors; Octopart Url: https://octopart.com/rc0603jr-130rl-yageo-9297262; Case/Package: 0603; OctopartID: ee3b27bc163331fc; Resistance: 0.0 Ω
U2 = CMP-260decfc55bff9ca-2: Single 300mA LDO with Enable Pull-Down & Auto Discharge 5 SOT-23 T/R RoHS Compliant: Yes; Lifecycle Status: Not Listed by Manufacturer; Manufacturer Part Number: MIC5504-2.8YM5-TR; Octopart URL: https://octopart.com/mic5504-2.8ym5-tr-microchip-66803412; OctopartID: 260decfc55bff9ca; Case/Package: SOT-23
U3 = CMP-260decfc55bff9ca-2: Single 300mA LDO with Enable Pull-Down & Auto Discharge 5 SOT-23 T/R RoHS Compliant: Yes; Manufacturer Part Number: MIC5504-1.2YM5-TR; Lifecycle Status: Not Listed by Manufacturer; Octopart URL: https://octopart.com/mic5504-2.8ym5-tr-microchip-66803412; OctopartID: 260decfc55bff9ca; Case/Package: SOT-23
X1 = CMP-6748af096d52b88f-1: Oscillator MEMS 24MHz Â±50ppm (Stability) 15pF 55% 1.8V/2.5V/3.3V Automotive 4-Pin QFN SMD T/R; Manufacturer Part Number: ASDMB-24.000MHZ-LC-T; Lead-Free Status: Lead Free; Octopart URL: http://octopart.com/asdmb-24.000mhz-lc-t-abracon-21704572; Packaging: Tape & Reel (TR); RoHS: Compliant; OctopartID: 6748af096d52b88f

## Sheet esc_servo.SchDoc
size A4
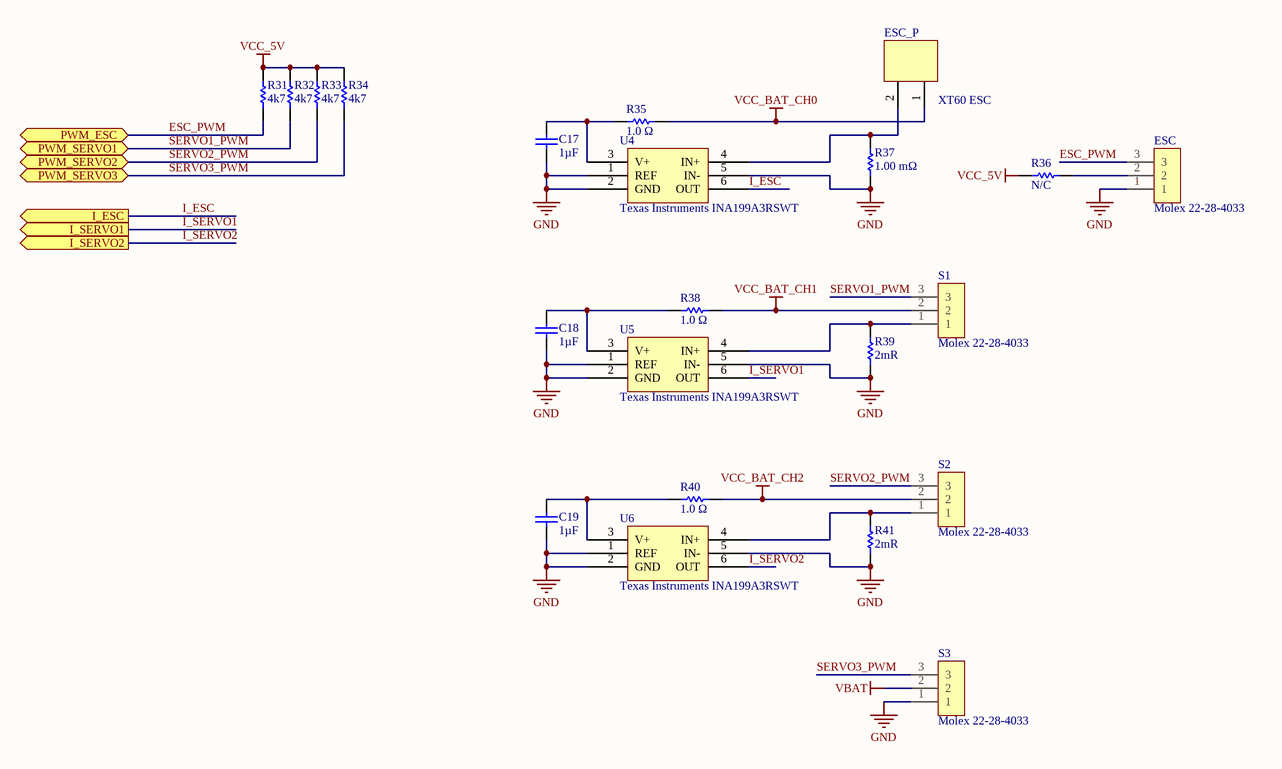
[diagram p9: esc_servo.SchDoc]

### Parts
C17  1µF  [CAPC1608X90X35LL15T15]
C18  1µF  [CAPC1608X90X35LL15T15]
C19  1µF  [CAPC1608X90X35LL15T15]
ESC  Molex 22-28-4033  [PCB-8kup8qw5vsmkearo8v0b-1]
ESC_P  XT60 ESC  [PCB-8tmbcd94dx0l5ponnqur-1]
R31  4k7  [RESC1608X55X30NL15T15]
R32  4k7  [RESC1608X55X30NL15T15]
R33  4k7  [RESC1608X55X30NL15T15]
R34  4k7  [RESC1608X55X30NL15T15]
R35  1.0 Ω  [RESC1609X50X30LL10T20]
R36  N/C  [RESC1608X55X25LL10T15]
R37  1.00 mΩ  [PCB-wws5gc0zzodyoofoa1sn-1]
R38  1.0 Ω  [RESC1609X50X30LL10T20]
R39  2mR  [RESC3216X89X51ML25T25]
R40  1.0 Ω  [RESC1609X50X30LL10T20]
R41  2mR  [RESC3216X89X51ML25T25]
S1  Molex 22-28-4033  [PCB-8kup8qw5vsmkearo8v0b-1]
S2  Molex 22-28-4033  [PCB-8kup8qw5vsmkearo8v0b-1]
S3  Molex 22-28-4033  [PCB-8kup8qw5vsmkearo8v0b-1]
U4  Texas Instruments INA199A3RSWT  [PCB-dzg43p1s5wcf61j10amz-1]
U5  Texas Instruments INA199A3RSWT  [PCB-dzg43p1s5wcf61j10amz-1]
U6  Texas Instruments INA199A3RSWT  [PCB-dzg43p1s5wcf61j10amz-1]

### Ports
I_ESC (out), I_SERVO1 (out), I_SERVO2 (out), PWM_ESC, PWM_SERVO1, PWM_SERVO2, PWM_SERVO3

### Nets
GND: C17.2 C18.2 C19.2 ESC.1 R37.1 R39.1 R41.1 S3.1 U4.1(REF) U4.2(GND) U4.5(IN-) U5.1(REF) U5.2(GND) U5.5(IN-) U6.1(REF) U6.2(GND) U6.5(IN-)
VBAT: S3.2
VCC_5V: R31.2 R32.2 R33.2 R34.2 R36.2
VCC_BAT_CH0: ESC_P.1 R35.2
VCC_BAT_CH1: R38.2 S1.2
VCC_BAT_CH2: R40.2 S2.2
ESC_PWM: ESC.3 R31.1 ; port PWM_ESC
I_ESC: U4.6(OUT) ; port I_ESC  [project net ADC_CH14]
I_SERVO1: U5.6(OUT) ; port I_SERVO1  [project net ADC_CH9]
I_SERVO2: U6.6(OUT) ; port I_SERVO2  [project net ADC_CH8]
SERVO1_PWM: R32.1 S1.3 ; port PWM_SERVO1
SERVO2_PWM: R33.1 S2.3 ; port PWM_SERVO2
SERVO3_PWM: R34.1 S3.3 ; port PWM_SERVO3
NetC17_1: C17.1 R35.1 U4.3(V+)
NetC18_1: C18.1 R38.1 U5.3(V+)
NetC19_1: C19.1 R40.1 U6.3(V+)
NetESC_2: ESC.2 R36.1
NetESC_P_2: ESC_P.2 R37.2 U4.4(IN+)
NetR39_2: R39.2 S1.1 U5.4(IN+)
NetR41_2: R41.2 S2.1 U6.4(IN+)

### Library data of the parts
C17-C19 = CMP-f2f83b8d074c2d3f-6: 0603 1 uF 16 V ±10 % Tolerance X5R SMT Multilayer Ceramic Capacitor; Capacitance Tolerance: ±10%; Lead-Free Status: Lead Free; Voltage Rating (DC): 16.0 V; Dielectric Characteristic: X5R; Mounting Style: Surface Mount; OctopartID: f2f83b8d074c2d3f
ESC S1-S3 = CMP-b995709ba24d6652-18: SERVAL TRIJUMPER; Gender: Male; Current Rating: 4.00 A; Number of Circuits: 3; Voltage Rating (DC): 250 V; Pin Pitch: 2.54 mm; Glow Wire Compliant: Non-Compliant; Number of Rows: 1; Operating Temperature: 75.0 °C (max); Halogen Free Status: Not Low Halogen; Contact Material: Phosphor Bronze; Octopart URL: https://octopart.com/22-28-4033-molex-278206; Housing Color: Black; Size-Length: 7.62 mm; Contact Plating: Gold; RoHS: Compliant; Manufacturer Part Number: 22-28-4033; OctopartID: b995709ba24d6652; Housing Material: Nylon; Mounting Style: Through Hole; Flammability Rating: UL 94 V-0; Packaging: Bulk; REACH SVHC Compliance: No SVHC; Number of Positions: 3; Orientation: Vertical; Size-Height: 2.29 mm
ESC_P = CMP-d8151592827e07d2-9: XT60 Connector Male
R31-R34 = CMP-e2bf28f8a65d3d78-11: Res Thick Film 0603 4.7K Ohm 1% 1/10W ±100ppm/°C Molded SMD Paper T/R; Mounting Style: Surface Mount
R35 R38 R40 = CMP-1856057-2: RES SMD 1 OHM 5% 1/10W 0603; Manufacturer Part Number: CRCW06031R00JNEA; Lead-Free Status: Lead Free; Power Rating: 0.1 W; Temperature Coefficient: 200.0 ppm/°C; Voltage Rating (DC): 75.0 V; Case/Package: 0603; Mounting Style: Surface Mount; Number of Pins: 2; Octopart Url: https://octopart.com/crcw06031r00jnea-vishay-39838014; OctopartID: a4176f42604f7bd0; Packaging: Cut Tape (CT); Resistance: 1.0 Ω; Resistance Tolerance: ±5%; RoHS: Compliant; Size-Height: 0.00045 m; Size-Length: 0.00155 m; Size-Width: 0.00085 m
R36 = CMP-3661350-4: Thick Film Resistors - SMD ZERO OHM JUMPER; Voltage Rating (DC): 50.0 V; Lead-Free Status: Lead Free; Resistance Tolerance: ±5%; Resistance: 0.0 Ω; Octopart Url: https://octopart.com/rc0603jr-130rl-yageo-9297262; Case/Package: 0603; OctopartID: ee3b27bc163331fc
R37 = CMP-5c9b974035f1835c-1: Res Thick Film 2512 0.001 Ohm 1% 3W ±50ppm/C Pad SMD Automotive T/R; Manufacturer Part Number: CRE2512-FZ-R001E-3; Power Rating: 3.00 W; Temperature Coefficient: -75.0 ppm/°C to 75.0 ppm/°C; Mounting Style: Solder; RoHS: Compliant; Packaging: Tape & Reel (TR), Cut Tape (CT); Resistance: 1.00 mΩ; Resistance Tolerance: ±1%; OctopartID: 5c9b974035f1835c; Octopart URL: https://octopart.com/cre2512-fz-r001e-3-bourns-47270924; REACH SVHC Compliance: No SVHC
R39 R41 = CMP-1863047-2: Res Metal Strip 1206 0.02 Ohm 1% 0.25W(1/4W) ±75ppm/C Molded SMD Automotive Embossed Plastic T/R; Manufacturer Part Number: WSL1206R0200FEA; Case/Package (SI): 3216; Lead-Free Status: Lead Free; Resistance: 0.02 Ω; Mounting Style: Surface Mount; Number of Pins: 2; Octopart Url: https://octopart.com/wsl1206r0200fea-vishay-39744192; OctopartID: 364ffd1b61e9e988; Power Rating: 0.25 W; REACH SVHC Compliance: No SVHC; Resistance Tolerance: ±1%; RoHS: Compliant; Size-Height: 0.000635 m; Size-Length: 0.0032004 m; Size-Width: 0.0016002 m
U4-U6 = CMP-0f05c77d0cddd0c2-11: 26-V, Bi-Directional, Zero-Drift, Low- or High-Side, Voltage Output Current Shunt Monitor 6-SC70 -40 to 125; Lead-Free Status: Lead Free; Mounting Style: Surface Mount; RoHS: Compliant; Octopart URL: http://octopart.com/ina199b3dckr-texas+instruments-24258238; OctopartID: 0f05c77d0cddd0c2

## Nets that join several sheets
GND: mcu (47 pins), aux_powers (27 pins), sensors (17 pins), external_connector (18 pins), power_connector (27 pins), power_suppliers (16 pins), memory (6 pins), camera (11 pins), esc_servo (17 pins)
VBAT: aux_powers (9 pins), power_connector (6 pins), power_suppliers (8 pins), esc_servo (S3.2)
VCC_3.3V: mcu (35 pins), aux_powers (6 pins), sensors (9 pins), external_connector (11 pins), power_suppliers (C50.1 C51.1 L2.2 R84.2), memory (C32#1.1 C32#2.2 SD.4 U21.8), camera (C14.2 U2.1)
VCC_5V: mcu (C29.1 DEBUG.8 J26.1), aux_powers (9 pins), external_connector (9 pins), power_suppliers (C44.1 C45.1 L1.2 R82.2), esc_servo (5 pins)
VCC_BAT_CH0: aux_powers (Q1.D), esc_servo (ESC_P.1 R35.2)
VCC_BAT_CH1: aux_powers (Q2.3), esc_servo (R38.2 S1.2)
VCC_BAT_CH2: aux_powers (Q3.3), esc_servo (R40.2 S2.2)
VREF+: mcu (C28.2 R63.2 U8.32), power_connector (NTC0.1 NTC1.1 R90.2)
ACC_CS: mcu (U8.128), sensors (U19.5)
ACC_INT: mcu (U8.132), sensors (U19.1)
ADC_CH0: mcu (U8.28), power_connector (C38.2 NTC0.2 R74.1)
ADC_CH1: mcu (U8.29), power_connector (C33.2 R66.1 R69.2)
ADC_CH4: mcu (U8.44), power_connector (U14.6)
ADC_CH5: mcu (U8.47), external_connector (R88.1)
ADC_CH7: mcu (U8.43), power_connector (U15.6)
ADC_CH8: mcu (U8.45), esc_servo (U6.6)
ADC_CH9: mcu (U8.46), esc_servo (U5.6)
ADC_CH10: mcu (U8.26), power_connector (C39.2 R75.1 R78.2)
ADC_CH11: mcu (U8.27), power_connector (C36.2 NTC1.2 R72.2)
ADC_CH14: mcu (U8.36), esc_servo (U4.6)
ADC_CH16: mcu (U8.34), power_connector (U12.6)
ADC_CH17: mcu (U8.35), power_connector (U11.6)
AUX_I2C_SCL: mcu (R59.1 U8.54), external_connector (I2C.2 I2C_MAG.2)
AUX_I2C_SDA: mcu (R60.1 U8.55), external_connector (I2C.3 I2C_MAG.3)
AUX_SPI1_CS1: mcu (U8.64), external_connector (SPI1.5)
AUX_SPI1_CS2: mcu (U8.63), external_connector (SPI1.6)
AUX_SPI1_IO: mcu (U8.60), external_connector (SPI1.7)
AUX_SPI1_MISO: mcu (U8.67), external_connector (SPI1.3 SPI2.3)
AUX_SPI1_MOSI: mcu (U8.66), external_connector (SPI1.4 SPI2.4)
AUX_SPI1_SCK: mcu (U8.65), external_connector (SPI1.2 SPI2.2)
AUX_SPI2_CS1: mcu (U8.87), external_connector (SPI2.5)
AUX_SPI2_CS2: mcu (U8.88), external_connector (SPI2.6)
AUX_SPI2_IO: mcu (U8.89), external_connector (SPI2.7)
AUX_UART1_RX: mcu (U8.59), external_connector (UART1.3)
AUX_UART1_TX: mcu (U8.58), external_connector (UART1.2)
AUX_UART2_RX: mcu (U8.142), external_connector (UART2.3)
AUX_UART2_TX: mcu (U8.141), external_connector (UART2.2)
BAT0_EN: mcu (U8.41), power_connector (U10.5)
BAT1_EN: mcu (U8.48), power_connector (U13.5)
BME_CS: mcu (U8.1), sensors (U18.2)
BUZZER: mcu (U8.69), external_connector (R50.1)
CAM_EN: mcu (U8.118), camera (U2.3 U3.3 X1.1)
CAM_PWDN: mcu (U8.110), camera (CAMERA.8)
CAM_RESET: mcu (U8.116), camera (CAMERA.6)
CAN_EN: mcu (U8.93), external_connector (U7.5 U7.8)
D0: mcu (U8.96), camera (CAMERA.24)
D1: mcu (U8.97), camera (CAMERA.23)
D2: mcu (U8.98), camera (CAMERA.19)
D3: mcu (U8.99), camera (CAMERA.21)
D4: mcu (U8.112), camera (CAMERA.22)
D5: mcu (U8.117), camera (CAMERA.20)
D6: mcu (U8.4), camera (CAMERA.18)
D7: mcu (U8.5), camera (CAMERA.16)
D8: mcu (U8.111), camera (CAMERA.14)
D9: mcu (U8.113), camera (CAMERA.12)
DCMI_HSYNC: mcu (U8.40), camera (CAMERA.9)
DCMI_PIXCLK: mcu (U8.42), camera (CAMERA.17)
DCMI_VSYNC: mcu (U8.137), camera (CAMERA.7)
ESC_PWM: mcu (U8.86), esc_servo (ESC.3 R31.1)
FDCAN1_RX: mcu (U8.114), external_connector (U7.4)
FDCAN1_TX: mcu (U8.115), external_connector (U7.1)
GPS_EN: mcu (U8.49), external_connector (GPS.4)
GPS_PPS: mcu (U8.50), external_connector (GPS.5)
GPS_RX: mcu (U8.57), external_connector (GPS.3)
GPS_TX: mcu (U8.56), external_connector (GPS.2)
GYRO_CS: mcu (U8.119), sensors (U19.14)
GYRO_INT: mcu (U8.129), sensors (U19.13)
I2C1_SCL: mcu (R55.1 U8.139), aux_powers (U1.2), sensors (U20.1)
I2C1_SDA: mcu (R56.1 U8.140), aux_powers (U1.4), sensors (U20.16)
I2C2_SCL: mcu (R57.1 U8.11), camera (CAMERA.5)
I2C2_SDA: mcu (R58.1 U8.10), camera (CAMERA.3)
LED: mcu (U8.70), external_connector (R54.1)
MCO_OUT: mcu (U8.100), camera (R29.2)
MISO: mcu (U8.135), sensors (U18.5 U19.10 U19.15)
MOSI: mcu (U8.134), sensors (U18.3 U19.9)
QSPI1_CLK: mcu (U8.22), memory (U21.6)
QSPI1_D0: mcu (U8.20), memory (U21.5)
QSPI1_D1: mcu (U8.21), memory (U21.2)
QSPI1_D2: mcu (U8.19), memory (U21.3)
QSPI1_D3: mcu (U8.18), memory (U21.7)
QSPI1_FLASH_CS: mcu (U8.136), memory (U21.1)
SCK: mcu (U8.133), sensors (U18.4 U19.8)
SD_DETECT: mcu (U8.2), memory (SD.S0)
SDIO_CLK: mcu (U8.122), memory (SD.5)
SDIO_CMD: mcu (U8.123), memory (SD.3)
SDIO_D0: mcu (U8.124), memory (SD.7)
SDIO_D1: mcu (U8.125), memory (SD.8)
SDIO_D2: mcu (U8.126), memory (SD.1)
SDIO_D3: mcu (U8.127), memory (SD.2)
SERVO1_PWM: mcu (U8.81), esc_servo (R32.1 S1.3)
SERVO2_PWM: mcu (U8.82), esc_servo (R33.1 S2.3)
SERVO3_PWM: mcu (U8.85), esc_servo (R34.1 S3.3)
TELE1_USART_CTS: mcu (U8.75), external_connector (TELE1.4)
TELE1_USART_RTS: mcu (U8.80), external_connector (TELE1.5)
TELE1_USART_RX: mcu (U8.77), external_connector (TELE1.3)
TELE1_USART_TX: mcu (U8.78), external_connector (TELE1.2)
TELE2_USART_CTS: mcu (U8.79), external_connector (TELE2.4)
TELE2_USART_RTS: mcu (U8.76), external_connector (TELE2.5)
TELE2_USART_RX: mcu (U8.74), external_connector (TELE2.3)
TELE2_USART_TX: mcu (U8.73), external_connector (TELE2.2)